# EAGLE design Brigid_control_board (EAGLE 7.7.0)
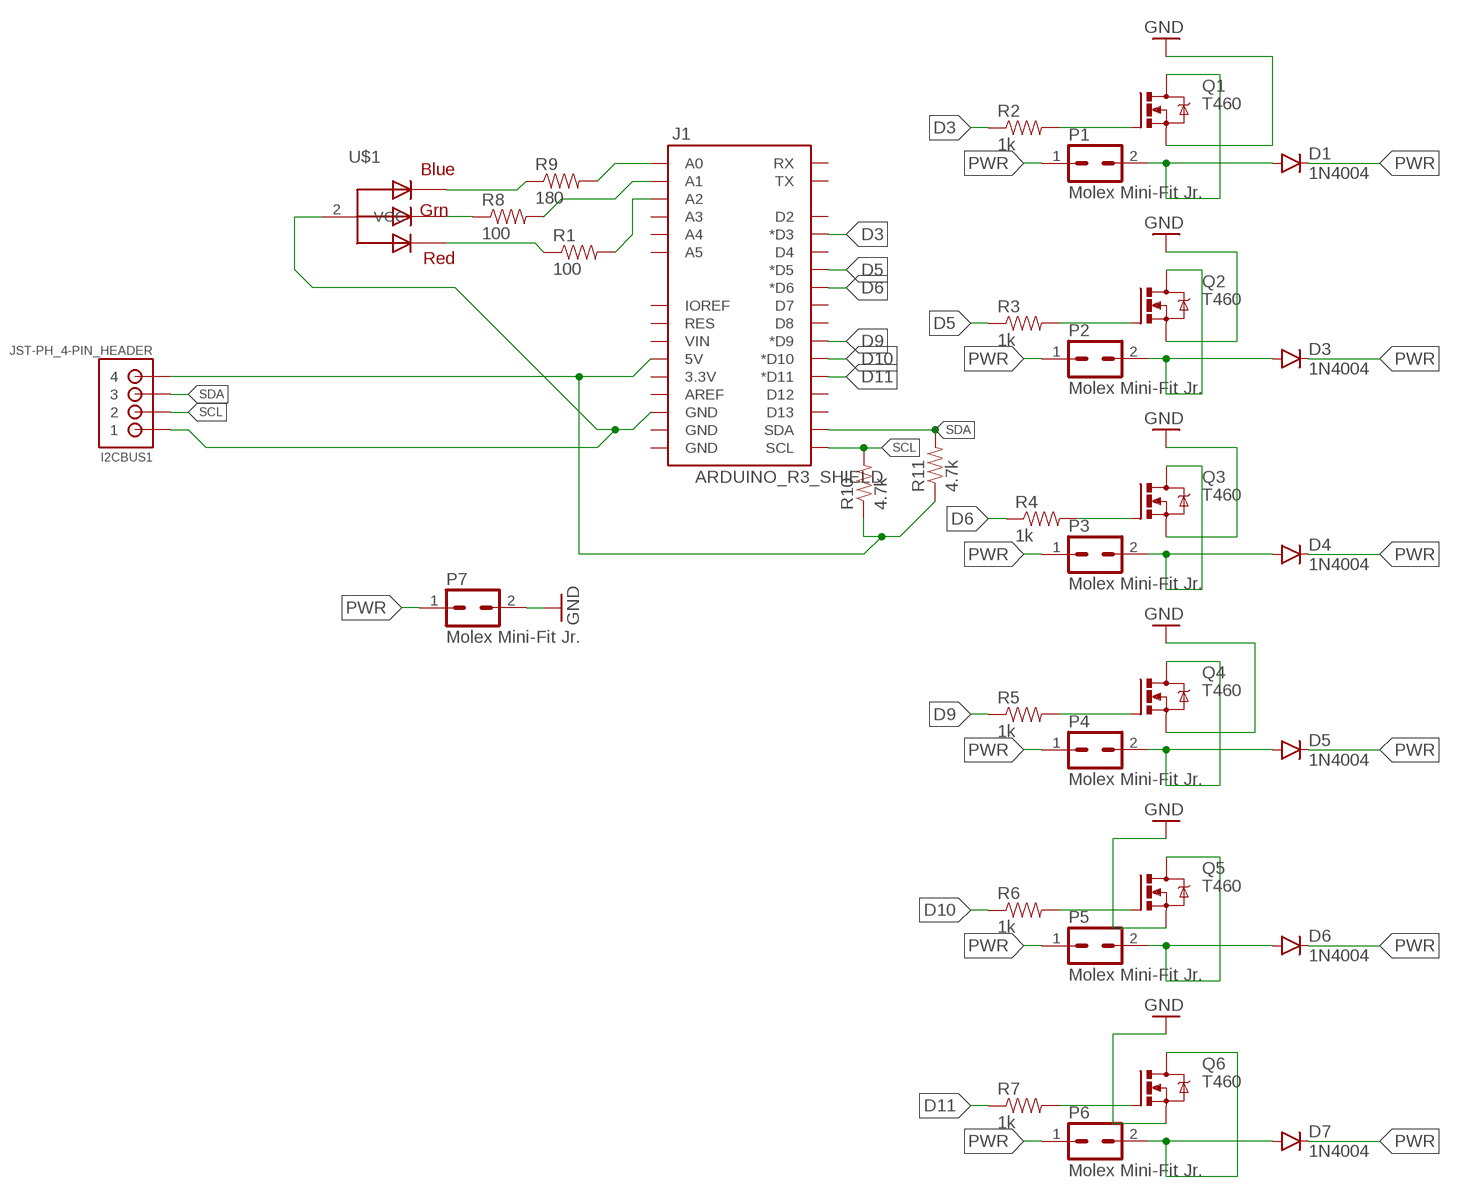
[diagram p0: schematic, sheet 1]

## Parts
D1  1N4004  DIODEPTH  [DIODE-1N4001]
D3  1N4004  DIODEPTH  [DIODE-1N4001]
D4  1N4004  DIODEPTH  [DIODE-1N4001]
D5  1N4004  DIODEPTH  [DIODE-1N4001]
D6  1N4004  DIODEPTH  [DIODE-1N4001]
D7  1N4004  DIODEPTH  [DIODE-1N4001]
I2CBUS1  JST-PH_4-PIN_HEADER  [JST_B4B-PH_HEADER]
J1  ARDUINO_R3_SHIELD  [UNO_R3_SHIELD]
P1  Molex Mini-Fit Jr.  39-30-02  [39-30-?02?]
P2  Molex Mini-Fit Jr.  39-30-02  [39-30-?02?]
P3  Molex Mini-Fit Jr.  39-30-02  [39-30-?02?]
P4  Molex Mini-Fit Jr.  39-30-02  [39-30-?02?]
P5  Molex Mini-Fit Jr.  39-30-02  [39-30-?02?]
P6  Molex Mini-Fit Jr.  39-30-02  [39-30-?02?]
P7  Molex Mini-Fit Jr.  39-30-02  [39-30-?02?]
Q1  T460  IRF540  [TO220BV]
Q2  T460  IRF540  [TO220BV]
Q3  T460  IRF540  [TO220BV]
Q4  T460  IRF540  [TO220BV]
Q5  T460  IRF540  [TO220BV]
Q6  T460  IRF540  [TO220BV]
R1  100  RESISTOREZ  [AXIAL-0.3EZ]
R2  1k  RESISTOREZ  [AXIAL-0.3EZ]
R3  1k  RESISTOREZ  [AXIAL-0.3EZ]
R4  1k  RESISTOREZ  [AXIAL-0.3EZ]
R5  1k  RESISTOREZ  [AXIAL-0.3EZ]
R6  1k  RESISTOREZ  [AXIAL-0.3EZ]
R7  1k  RESISTOREZ  [AXIAL-0.3EZ]
R8  100  RESISTOREZ  [AXIAL-0.3EZ]
R9  180  RESISTOREZ  [AXIAL-0.3EZ]
R10  4.7k  RESISTOREZ  [AXIAL-0.3EZ]
R11  4.7k  RESISTOREZ  [AXIAL-0.3EZ]
U$1  RGB LED  RGBLED_CA  [LED5MMRGB]

## Nets
D3: J1.D3(*D3) R2.P$1
D5: J1.D5(*D5) R3.P$1
D6: J1.D6(*D6) R4.P$1
D9: J1.D9(*D9) R5.P$1
D10: J1.D10(*D10) R6.P$1
D11: J1.D11(*D11) R7.P$1
GND: P7.2 Q1.S Q2.S Q3.S Q4.S Q5.S Q6.S
N$1: J1.A0 R9.P$2
N$2: J1.A1 R8.P$2
N$3: D1.A P1.2 Q1.D
N$4: J1.A2 R1.P$2
N$5: R9.P$1 U$1.4(BLUE)
N$7: R1.P$1 U$1.1(RED)
N$8: R8.P$1 U$1.3(GREEN)
N$9: Q2.G R3.P$2
N$10: D3.A P2.2 Q2.D
N$11: Q1.G R2.P$2
N$12: Q3.G R4.P$2
N$13: D4.A P3.2 Q3.D
N$15: Q4.G R5.P$2
N$16: D5.A P4.2 Q4.D
N$17: I2CBUS1.P4 J1.5V R10.P$1 R11.P$1
N$18: Q5.G R6.P$2
N$19: D6.A P5.2 Q5.D
N$20: I2CBUS1.P1 J1.GND@2(GND) U$1.2(VCC)
N$21: Q6.G R7.P$2
N$22: D7.A P6.2 Q6.D
PWR: D1.C D3.C D4.C D5.C D6.C D7.C P1.1 P2.1 P3.1 P4.1 P5.1 P6.1 P7.1
SCL: I2CBUS1.P2 J1.SCL R10.P$2
SDA: I2CBUS1.P3 J1.SDA R11.P$2
Unconnected: J1.3.3V J1.A3 J1.A4 J1.A5 J1.AREF J1.D2 J1.D4 J1.D7 J1.D8 J1.D12 J1.D13 J1.GND@0(GND) J1.GND@1(GND) J1.IOREF J1.RES J1.RX J1.TX J1.VIN

## Library data of the parts
D1 D3-D7 = SparkFun-DiscreteSemi:DIODE: Diode These are standard reverse protection diodes and small signal diodes. SMA package can handle up to about 1A. SOD-323 can handle about 200mA. What the SOD-323 package when ordering, there are some mfgs out there that are 5-pin packages.
I2CBUS1 = JST_connectors:JST-PH_4-PIN_HEADER: 4-pin JST PH Shrouded Header, top entry P/N B4B-PH-K-S Mating connector PHR-4 Mating cable assembly: Sparkfun PRT-09916 <http://www.sparkfun.com/products/9916>
J1 = Nathans-Arduinos2:ARDUINO_R3_SHIELD: Shield form compatible with the Arduino Uno R3.
P1-P7 = con-molex-mini-fit:39-30-?02?: HEADER
Q1-Q6 = transistor-power:IRF540: HEXFET Power MOSFET
R1-R11 = SparkFun-Passives:RESISTOR: Resistor Basic schematic elements and footprints for 0603, 1206, and PTH resistors.
U$1 = adafruit:RGBLED_CA: RGB LED, common-anode Staggered pins http://www.ladyada.net/library/pcb/eaglelibrary.html

## Net classes
0 default: width 0.61 mm, drill 0.406 mm, clearance 0.406 mm

## Board
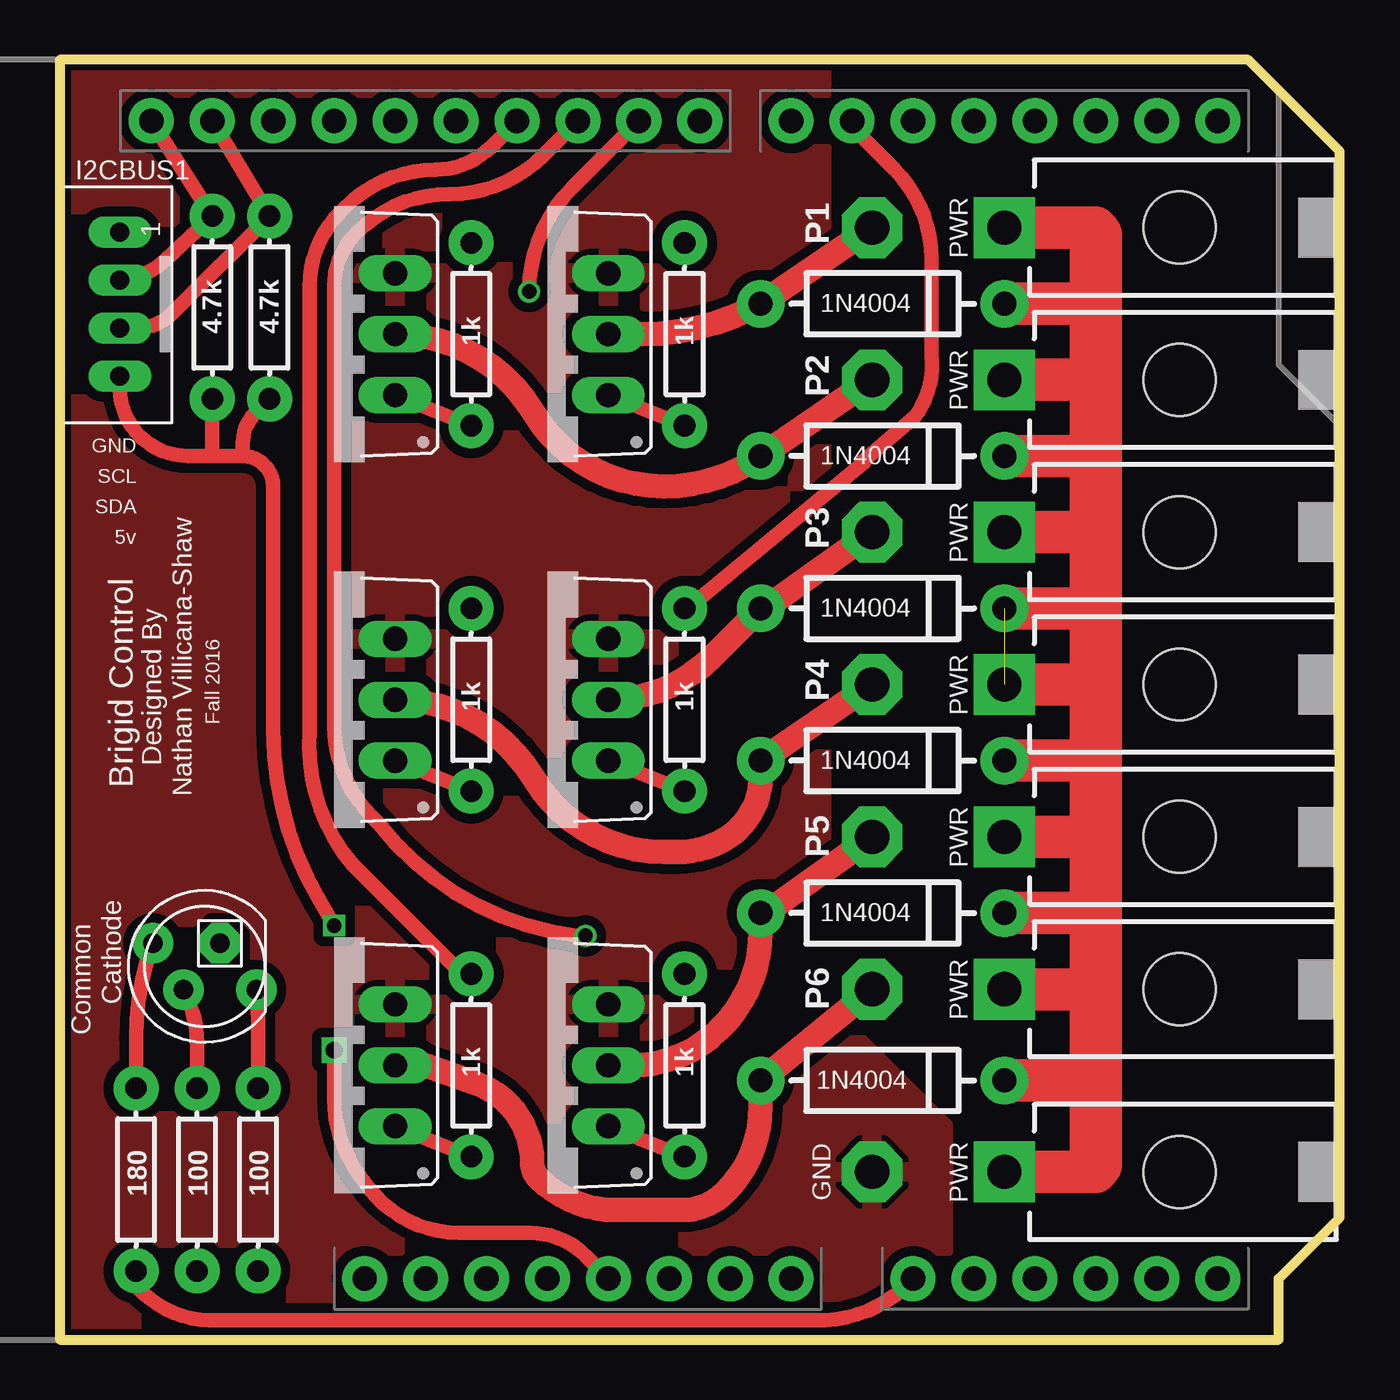
[diagram p1: board, top side]
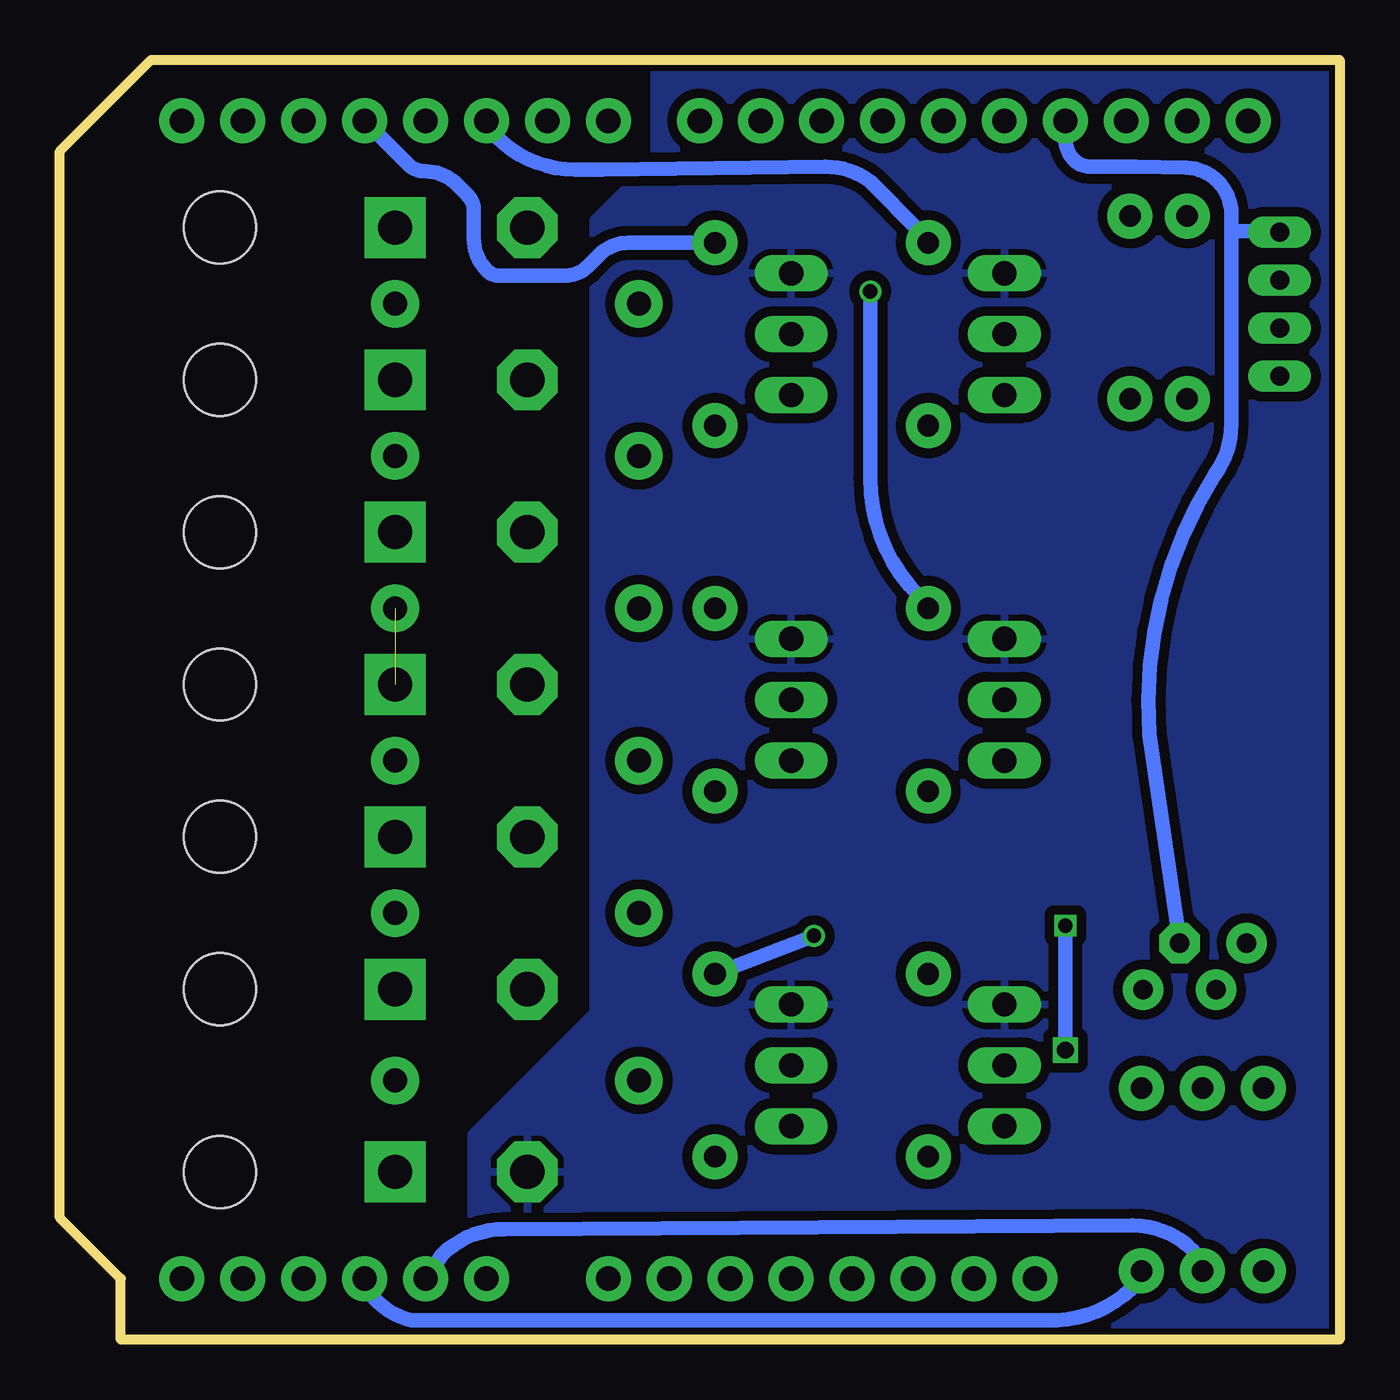
[diagram p2: board, bottom side, seen from below]

Size 53.34 x 53.34 mm. Coordinates in mm from the lower left corner, seen from the top.
Outline: 0,0 50.8,0 50.8,2.54 53.34,5.08 53.34,49.53 49.53,53.34 0,53.34 0,0
Copper layers (1*16): Top 0.035mm / dielectric 1.5mm / Bottom 0.035mm
Design rules "SeeedStudio_2layer_DRU_no_angle_20140221": minimum track width 6mil, minimum drill 12mil, track to track 6mil, track to pad 6mil, pad to pad 6mil, via to via 6mil, smd to smd 0mil, copper to edge 10mil, drill to drill 10mil, minimum pad ring 10mil, minimum via ring 6mil, stop-mask expansion 2mil, vias tented up to drill 100mil, thermal gap 10mil

### Footprints (pad centres in the part's own frame; a part is rotated, then mirrored left to right if it is on the bottom)
DIODE-1N4001 = drill 1 pad 1.981: A -5.08,0; C 5.08,0
JST_B4B-PH_HEADER = drill 0.8 long: P1 2.98,0.048; P2 0.98,0.048; P3 -1.02,0.048; P4 -3.02,0.048
UNO_R3_SHIELD = drill 1.016 pad 1.88: 3.3V 50.8,26.67; 5V 50.8,29.21; A0 50.8,41.91; A1 50.8,44.45; A2 50.8,46.99; A3 50.8,49.53; A4 50.8,52.07; A5 50.8,54.61; AREF 2.54,15.24; D2 2.54,49.53; D3 2.54,46.99; D4 2.54,44.45; D5 2.54,41.91; D6 2.54,39.37; D7 2.54,36.83; D8 2.54,33.02; D9 2.54,30.48; D10 2.54,27.94; D11 2.54,25.4; D12 2.54,22.86; D13 2.54,20.32; GND@0 50.8,31.75; GND@1 50.8,34.29; GND@2 2.54,17.78; IOREF 50.8,21.59; NC 50.8,19.05; RES 50.8,24.13; RX 2.54,54.61; SCL 2.54,10.16; SDA 2.54,12.7; TX 2.54,52.07; VIN 50.8,36.83
39-30-?02? = drill 1.422 pad 2.54 square: 1 0,0 | drill 1.422 pad 2.54 octagon: 2 0,5.512 | hole 3: 0,-7.3
TO220BV = drill 1.016 long: D 0,-2.54; G -2.54,-2.54; S 2.54,-2.54
AXIAL-0.3EZ = drill 0.9 pad 1.88: P$1 -3.81,0; P$2 3.81,0
LED5MMRGB = drill 0.8 pad 1.676: 1 -2.159,0.968; 3 0.889,0.968; 4 2.159,-0.968 | drill 0.8 pad 1.676 octagon: 2 -0.635,-0.968

### Placement (x,y rotation side)
D1  34.29,43.18 0 top
D3  34.29,36.83 0 top
D4  34.29,30.48 0 top
D5  34.29,24.13 0 top
D6  34.29,17.78 0 top
D7  34.29,10.79 0 top
I2CBUS1  2.54,43.18 90 top
J1  -6.35,53.34 270 top
P1  39.37,46.35 90 top
P2  39.37,40.01 90 top
P3  39.37,33.66 90 top
P4  39.37,27.3 90 top
P5  39.37,20.95 90 top
P6  39.37,14.61 90 top
P7  39.37,6.99 90 top
Q1  20.32,41.91 90 top
Q2  11.43,41.91 90 top
Q3  20.32,26.67 90 top
Q4  11.43,26.67 90 top
Q5  20.32,11.43 90 top
Q6  11.43,11.43 90 top
R1  8.26,6.67 270 top
R2  26.04,41.91 270 top
R3  17.14,41.91 270 top
R4  26.04,26.67 270 top
R5  17.14,26.67 270 top
R6  26.04,11.43 270 top
R7  17.14,11.43 270 top
R8  5.71,6.67 270 top
R9  3.17,6.67 270 top
R10  6.35,43.02 90 top
R11  8.73,43.02 90 top
U$1  6.03,15.56 180 top

### Tracks (layer width: path | path; a pad name or v marks a point on that pad's centre or on a via)
D3
  Bottom 0.61: J1.D3 38.83,48.99 arc-45 38.11,48.7 arc45 36.79,48.15 36.35,47.7 arc45 36.09,47.09 36.09,45.9 arc-45 35.54,44.56 arc-45 35,44.34 32.31,44.34 arc-45 31.33,44.74 30.86,45.22 arc45 29.65,45.72 R2.P$1
D5
  Bottom 0.61: R3.P$1 17.53,45.72 17.53,46.23 19.56,48.26 arc-38 21.43,48.88 30.73,48.77 31.85,48.77 arc45 35.15,50.14 35.81,50.8 J1.D5
D6
  Top 0.61: R4.P$1 26.16,30.48 33.53,36.58 33.43,36.58 35.62,38.46 arc45 36.32,41.05 36.32,45.08 arc45 34.79,48.78 32.77,50.8 J1.D6
D9  (via drill 0.61)
  Top 0.61: J1.D9 21.35,48.02 arc45 v19.56,43.69
  Bottom 0.61: v19.56,43.69 19.56,35.89 arc-45 17.53,30.99 17.53,30.48 R5.P$1
D10  (via drill 0.6)
  Top 0.61: v21.91,16.83 21.53,16.83 arc-45 13.29,21.51 13.03,21.77 arc-45 11.43,25.63 11.43,43.87 arc-45 12.38,46.16 arc-45 16.21,47.75 16.27,47.75 arc45 20.15,49.36 J1.D10
  Bottom 0.61: R6.P$1 v21.91,16.83
D11
  Top 0.61: J1.D11 17.98,49.73 arc-45 15.65,48.77 arc45 11.91,47.22 11.69,47 arc45 10.41,43.91 10.41,25.39 arc45 12.2,19.8 17.02,14.99 17.02,15.24 R7.P$1
GND
  Top 0.813: 13.54,13.97 Q6.S
  pour Bottom: 0,53.34 0,0 31.75,0 36.2,4.45 36.2,8.57 31.11,13.65 31.11,46.67 28.57,49.21 28.57,53.34
  pour Top: 0,0 36.83,0 36.83,8.89 31.75,13.97 31.75,53.34 0,53.34
N$1
  Top 0.61: J1.A0 arc-45 31.88,0.8 6.21,0.8 arc-45 3.19,2.2 3.17,2.22 R9.P$2
N$2
  Bottom 0.61: J1.A1 37.44,3.52 arc45 34.82,4.6 8.62,4.76 arc45 6.11,3.72 R8.P$2
N$3
  Top 1.016: P1.2 D1.A 28.83,42.99 arc-27 24.25,41.91 Q1.D
N$4
  Bottom 0.61: J1.A2 40.55,2.13 arc-45 38.69,0.8 11.77,0.8 arc-45 8.37,2.42 8.26,2.54 R1.P$2
N$5
  Top 0.61: U$1.4 arc20 3.17,12.56 R9.P$1
N$6
  Top 2.184: 43.18,46.04 43.18,7.3
N$7
  Top 0.61: U$1.1 8.26,13.34 R1.P$1
N$8
  Top 0.61: U$1.3 5.31,14.22 arc-24 5.71,12.36 R8.P$1
N$9
  Top 0.61: R3.P$2 Q2.G
N$10
  Top 1.016: P2.2 D3.A 29.07,36.74 arc-34 25.18,35.56 arc-59 19.74,38.64 arc59 Q2.D
N$11
  Top 0.61: Q1.G R2.P$2
N$12
  Top 0.61: R4.P$2 Q3.G
N$13
  Top 1.016: P3.2 29.84,30.8 D4.A 27.2,28.47 arc-45 Q3.D
N$15
  Top 0.61: R5.P$2 Q4.G
N$16
  Top 1.016: P4.2 D5.A 29.21,23.48 arc-63 27.52,20.74 arc-27 25.72,20.32 25.18,20.32 arc-59 19.74,23.4 arc59 Q4.D
N$17  (via drill 0.6, 0.7)
  Top 0.61: J1.5V 21.9,3.5 arc45 19.61,4.45 16.65,4.45 arc-53 12.87,6.33 12.52,6.81 arc-37 11.43,10.06 v11.43,12.06 | v11.43,17.25 10.84,18.27 arc-30 8.89,25.44 8.89,35.56 arc90 7.62,36.83 | 7.62,36.83 6.35,36.83 | 6.35,36.83 5.34,36.83 arc-89 2.5,39.63 I2CBUS1.P4 | R10.P$1 6.35,36.83 | R11.P$1 8.15,38.63 arc45 7.62,37.36 7.62,36.83
  Bottom 0.61: v11.43,12.06 v11.43,17.25
N$18
  Top 0.61: R6.P$2 Q5.G
N$19
  Top 1.016: P5.2 29.84,18.1 D6.A 29.21,17.01 arc-56 26.68,12.28 arc-34 23.86,11.43 Q5.D
N$20
  Bottom 0.61: J1.GND@2 11.43,50.06 arc-45 11.06,49.16 arc-45 10.42,48.9 8.5,48.9 6.38,48.84 arc89 4.51,46.93 4.51,46.21 | 4.51,46.21 4.51,38.16 arc36 5.2,36.06 arc-36 7.94,25.23 U$1.2 | 2.54,46.21 4.51,46.21
  Bottom 0.813: I2CBUS1.P1 2.54,46.21
N$21
  Top 0.61: R7.P$2 Q6.G
N$22
  Top 1.016: P6.2 D7.A 29.21,9.72 arc-45 27.72,6.13 arc-45 25.95,5.4 23.14,5.4 arc-45 19.95,6.72 arc-45 19.68,7.36 arc70 17.35,10.68 15.24,11.43 Q6.D
PWR  (1 unrouted)
  Top 0.305: P6.1 43.18,13.97 | 43.18,17.78 43.18,20.95 | 43.18,30.48 43.18,24.13 | 43.18,33.02 43.18,36.83 | 43.18,39.37 43.18,43.18
  Top 1.778: P7.1 43.18,6.99 43.18,10.79 | 43.18,10.79 D7.C | P6.1 43.18,14.61 | D6.C 43.18,17.78 43.18,13.97 43.18,10.79 | P5.1 43.18,20.95 43.18,24.13 D5.C | P4.1 43.18,27.3 | D4.C 43.18,30.48 43.18,33.02 43.18,33.66 P3.1 | D3.C 43.18,36.83 43.18,39.37 43.18,40.01 P2.1 | D1.C 43.18,43.18 43.18,46.35 P1.1
SCL
  Top 0.61: I2CBUS1.P2 3.05,44.28 arc31 4.38,44.98 R10.P$2 J1.SCL
SDA
  Top 0.61: J1.SDA R11.P$2 4.64,42.74 arc-43 3.41,42.2 I2CBUS1.P3

### Text on the board
tNames: PWR | PWR | GND | SCL | SDA | 5v | Nathan Villicana-Shaw | PWR | Brigid Control | Designed By | Fall 2016 | PWR | PWR | PWR | Cathode | Common | GND | PWR